# EAGLE design imu_finger (EAGLE 9.1.3)
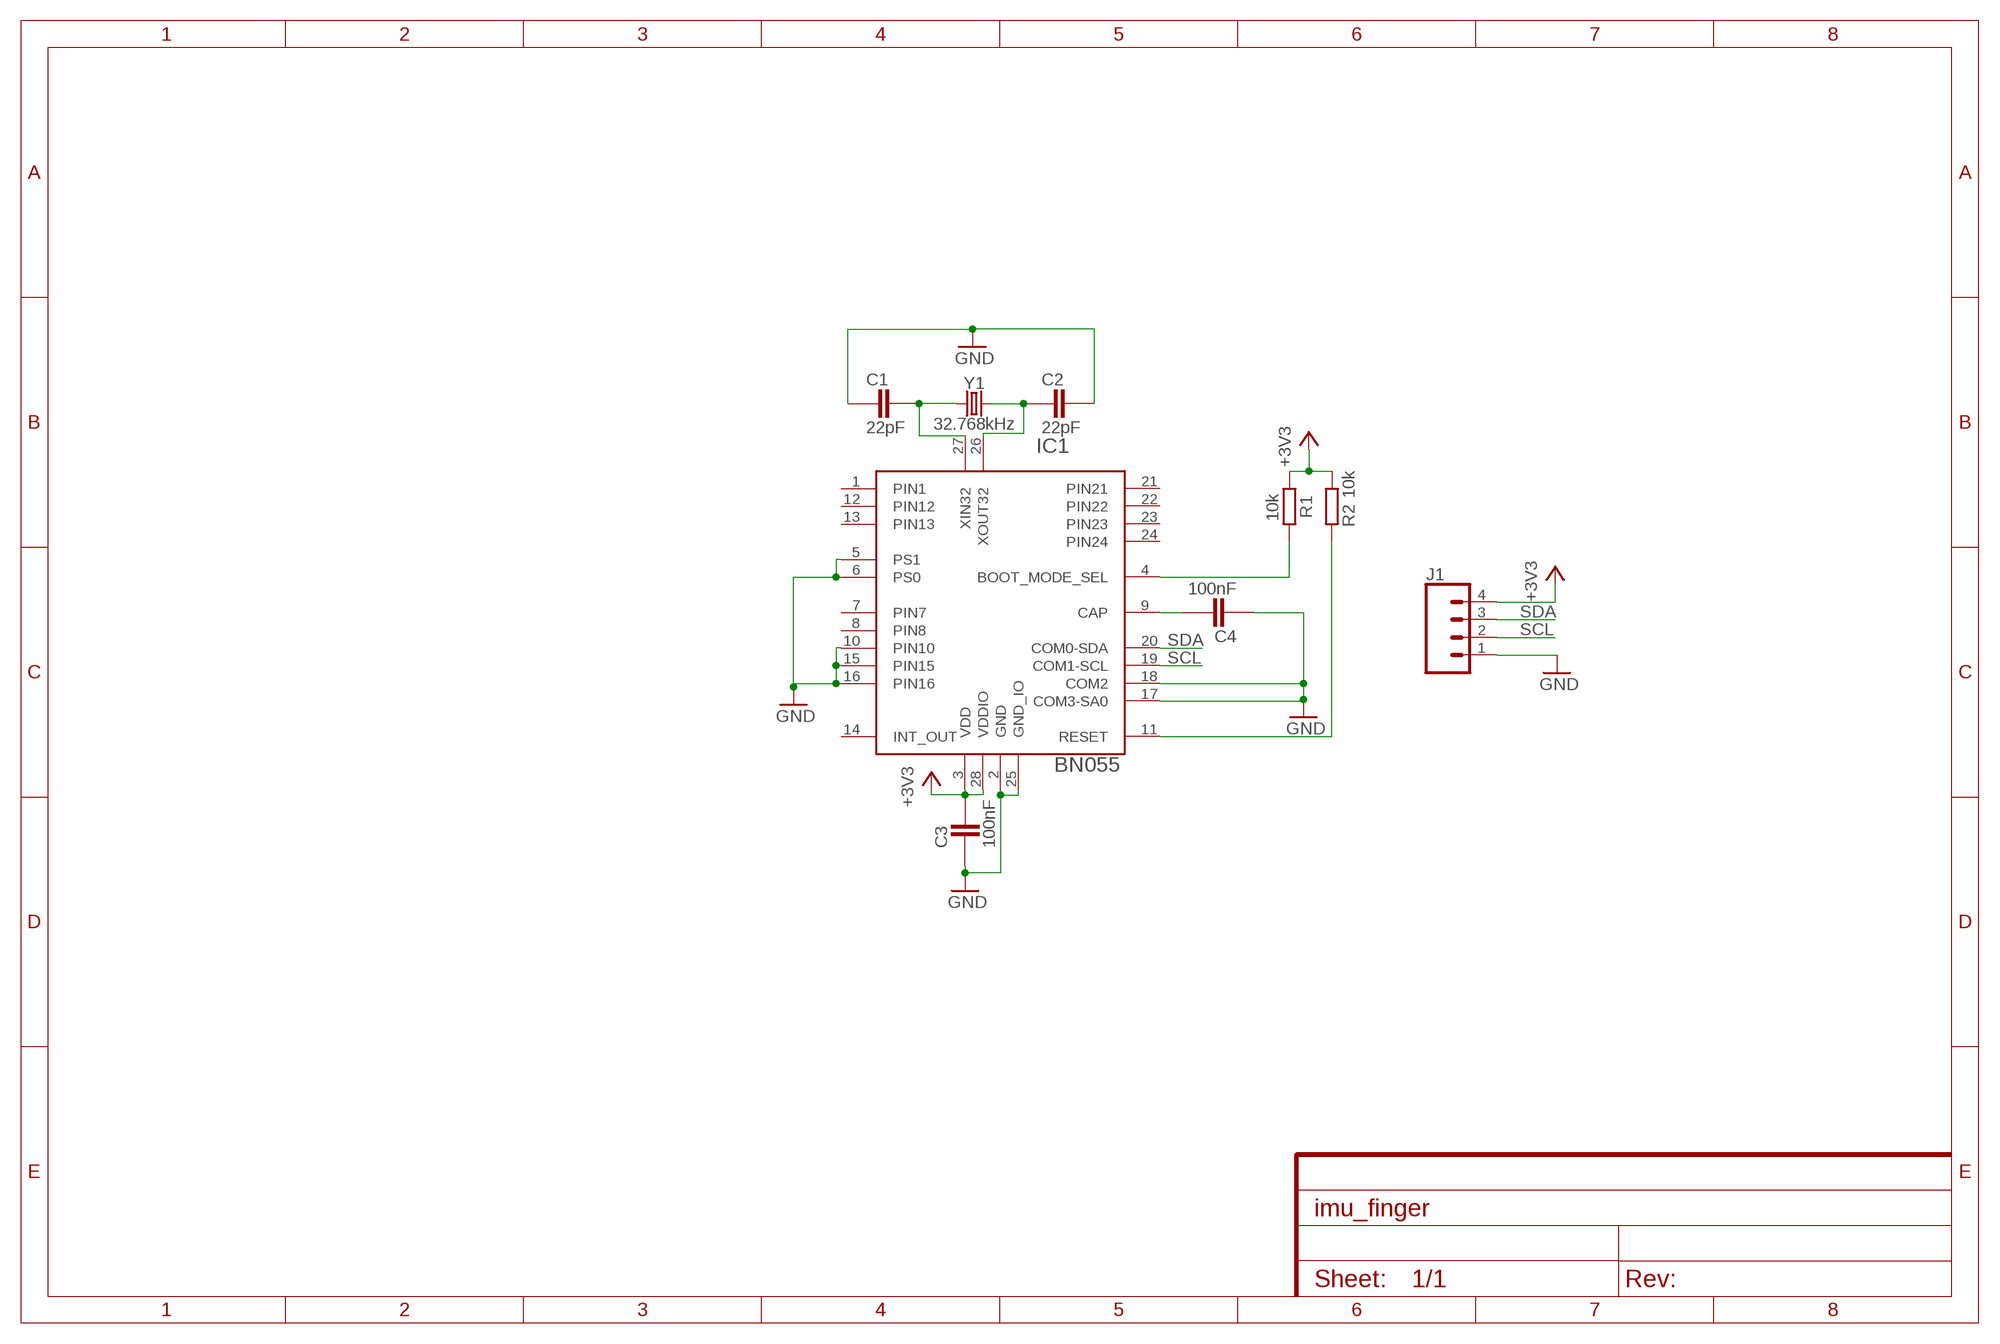
[diagram p0: schematic, sheet 1]

## Parts
C1  22pF  CAPACITOR_0603  [CAPC1608X92N]
C2  22pF  CAPACITOR_0603  [CAPC1608X92N]
C3  100nF  CAPACITOR_0603  [CAPC1608X92N]
C4  100nF  CAPACITOR_0603  [CAPC1608X92N]
IC1  BN055  1658_BNO055  [LGA-28_3.80X5.20/0.5]
J1  CONN_04SMD2  [1X04_1MM_RA]
R1  10k  RESISTOR_0603  [RESC1608X55N]
R2  10k  RESISTOR_0603  [RESC1608X55N]
Y1  32.768kHz  CRYSTAL-32.768KHZSMD-3.2X1.5  [CRYSTAL-SMD-3.2X1.5MM]

## Nets
+3V3: C3.2 IC1.3(VDD) IC1.28(VDDIO) J1.4 R1.1 R2.1
GND: C1.1 C2.2 C3.1 C4.1 IC1.2(GND) IC1.5(PS1) IC1.6(PS0) IC1.10(PIN10) IC1.15(PIN15) IC1.16(PIN16) IC1.17(COM3-SA0) IC1.18(COM2) IC1.25(GND_IO) J1.1
N$1: IC1.11(RESET) R2.2
N$2: IC1.4(BOOT_MODE_SEL) R1.2
N$3: C4.2 IC1.9(CAP)
N$4: C2.1 IC1.26(XOUT32) Y1.P$2
N$5: C1.2 IC1.27(XIN32) Y1.P$1
SCL: IC1.19(COM1-SCL) J1.2
SDA: IC1.20(COM0-SDA) J1.3
Unconnected: IC1.1(PIN1) IC1.7(PIN7) IC1.8(PIN8) IC1.12(PIN12) IC1.13(PIN13) IC1.14(INT_OUT) IC1.21(PIN21) IC1.22(PIN22) IC1.23(PIN23) IC1.24(PIN24)

## Library data of the parts
C1-C4 = ipc-7351-capacitor:CAPACITOR_
IC1 = BNO055:1658_BNO055: BN055 Intelligent 9-axis absolute orientation sensor; PART_NUMBER: BNO055
J1 = SparkFun-Connectors:CONN_04: Multi connection point. Often used as Generic Header-pin footprint for 0.1 inch spaced/style header connections On any of the 0.1 inch spaced packages, you can populate with these: Break Away Headers - Straight <https://www.sparkfun.com/products/116> (PRT-00116) Break Away Male Headers - Right Angle <https://www.sparkfun.com/products/553> (PRT-00553) Female Headers <https://www.sparkfun.com/products/115> (PRT-00115) Break Away Headers - Machine Pin <https://www.sparkfun.com/products/117> (PRT-00117) Break Away Female Headers - Swiss Machine Pin <https://www.sparkfun.com/products/743> (PRT-00743) For SCREWTERMINALS and SPRING TERMINALS visit here: Screw Terimnals on SparkFun.com <https://www.sparkfun.com/search/results?term=Screw+Terminals> (5mm/3.5mm/2.54mm spacing) This device is also useful as a general connection point to wire up your design to another part of your project. Our various solder wires solder well into these plated through hole pads. Hook-Up Wire - Assortment (Stranded, 22 AWG) <https://www.sparkfun.com/products/11375> (PRT-11375) Hook-Up Wire - Assortment (Solid Core, 22 AWG) <https://www.sparkfun.com/products/11367> (PRT-11367) View the entire wire category on our website here <https://www.sparkfun.com/categories/141> Special notes: Molex polarized connector foot print use with SKU : PRT-08231 with associated crimp pins and housings. 1MM SMD Version SKU: PRT-10208; PROD_ID: CONN-10310; SF_ID: PRT-10208
R1 R2 = ipc-7351-resistor:RESISTOR_
Y1 = SparkFun-Clocks:CRYSTAL-32.768KHZ: 32.768kHz Crystal Frequency: 32.768kHz Frequency Stability: ±20ppm Load Capacitance: 12.5pF (PTH-2X6 & SMD-3.2X1.5), 6pF (SMD-2X6) SparkFun Products: SparkFun BigTime Watch Kit <https://www.sparkfun.com/products/11734> SparkFun nRF52832 Breakout <https://www.sparkfun.com/products/13990> SparkFun Real Time Clock Module <https://www.sparkfun.com/products/12708>; PROD_ID: XTAL-13062

## Board
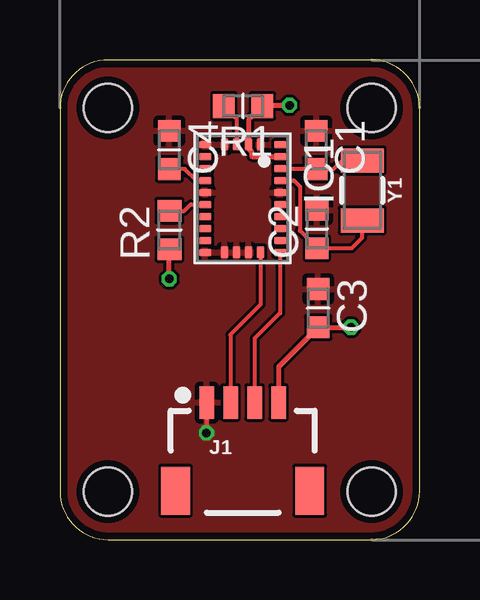
[diagram p1: board, top side]
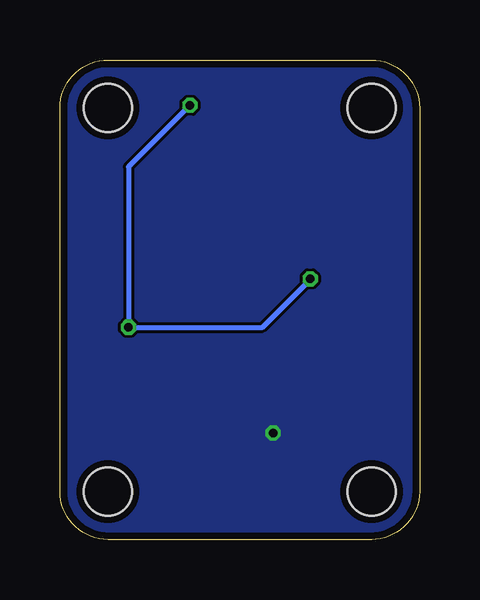
[diagram p2: board, bottom side, seen from below]

Size 15 x 20 mm. Coordinates in mm from the lower left corner, seen from the top.
Outline: 0,18 0,2 arc90 2,0 13,0 arc90 15,2 15,18 arc90 13,20 2,20 arc90 0,18
Copper layers (1*16): Top 0.035mm / dielectric 1.5mm / Bottom 0.035mm
Design rules "PCB-POOL HighSpec": minimum track width 0.125mm, minimum drill 0.2mm, track to track 0.125mm, track to pad 0.125mm, pad to pad 0.125mm, via to via 0.125mm, smd to smd 0.125mm, copper to edge 0.3mm, drill to drill 0.2mm, minimum pad ring 0.2mm, minimum via ring 0.125mm, stop-mask expansion 0.075mm, vias tented up to drill 0mil, thermal gap 0.2mm
Holes 2 mm at 2,18 13,18 2,2 13,2

### Footprints (pad centres in the part's own frame; a part is rotated, then mirrored left to right if it is on the bottom)
CAPC1608X92N = smd 0.9 x 0.95: 1 -0.8,0; 2 0.8,0
LGA-28_3.80X5.20/0.5 = smd 0.3 x 0.5: 1 -2.25,1.56; 6 -2.25,-1.56; 7 -1.75,-1.56; 8 -1.25,-1.56; 9 -0.75,-1.56; 10 -0.25,-1.56; 11 0.25,-1.56; 12 0.75,-1.56; 13 1.25,-1.56; 14 1.75,-1.56; 15 2.25,-1.56; 20 2.25,1.56; 21 1.75,1.56; 22 1.25,1.56; 23 0.75,1.56; 24 0.25,1.56; 25 -0.25,1.56; 26 -0.75,1.56; 27 -1.25,1.56; 28 -1.75,1.56 | smd 0.5 x 0.3: 2 -2.25,0.75; 3 -2.25,0.25; 4 -2.25,-0.25; 5 -2.25,-0.75; 16 2.25,-0.75; 17 2.25,-0.25; 18 2.25,0.25; 19 2.25,0.75
1X04_1MM_RA = smd 0.6 x 1.35: 1 -1.5,0; 2 -0.5,0; 3 0.5,0; 4 1.5,0 | smd 1.2 x 2: NC1 2.8,-3.675; NC2 -2.8,-3.675
RESC1608X55N = smd 0.9 x 1: 1 -0.8,0; 2 0.8,0
CRYSTAL-SMD-3.2X1.5MM = smd 1 x 1.8: P$1 -1.25,0; P$2 1.25,0

### Placement (x,y rotation side)
C1  10.69,16.25 270 top
C2  10.72,12.95 90 top
C3  10.77,9.65 270 top
C4  4.56,16.25 270 top
IC1  7.62,14.22 270 top
J1  7.62,5.71 0 top
R1  7.64,18.08 180 top
R2  4.57,12.91 90 top
Y1  12.61,14.56 270 top

### Tracks (layer width: path | path; a pad name or v marks a point on that pad's centre or on a via)
+3V3  (via drill 0.35)
  Top 0.16: R1.1 8.47,18.11 | 7.87,16.3 IC1.3 | C3.2 | R2.1
  Top 0.2: R1.1 7.87,17.51 IC1.3 7.87,16.3 8,16.17 8,16 8.02,15.97 IC1.28 | 8.47,18.11 v9.58,18.11 | C3.2 9.12,7.2 J1.4 | C3.2 v12.14,8.85 | v4.56,10.87 R2.1
  Bottom 0.16: 4.56,10.85 v4.56,10.87
  Bottom 0.2: v9.58,18.11 12.14,15.54 v12.14,8.85 6.56,8.85 4.56,10.85
GND  (via drill 0.35)
  Top 0.16: J1.1 v6.12,4.46 v6.11,4.45
  pour Top: 2,20 13,20 arc-90 15,18 15,2 arc-90 13,0 2,0 arc-90 0,2 0,18 arc-90
  pour Bottom: 2,20 13,20 arc-90 15,18 15,2 arc-90 13,0 2,0 arc-90 0,2 0,18 arc-90
N$1
  Top 0.16: R2.2 5.19,13.71 5.45,13.97 IC1.11
N$2
  Top 0.16: R1.2 7.37,17.55 IC1.4
N$3
  Top 0.16: IC1.9 5.69,14.97 5.21,15.46 C4.2
N$4
  Top 0.16: IC1.26 9.75,14.97 10.01,14.71 10.01,13.83 10.01,12.88 C2.1 12.18,12.15 12.61,12.59 Y1.P$2
N$5
  Top 0.16: Y1.P$1 11.84,15.88 11.41,15.45 C1.2 10.67,15.47 IC1.27
SCL
  Top 0.16: IC1.19 8.37,9.8 7.11,8.55 7.11,5.72 J1.2
SDA
  Top 0.16: IC1.20 9.18,9.45 8.12,8.39 J1.3

### Text on the board
tDocu: All dimensions are in mm